# EAGLE design USB Breakout v0.3 (EAGLE 7.1.0)
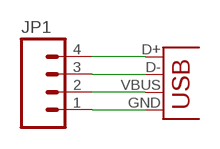
[diagram p0: schematic, sheet 1]

## Parts
JP1  M04LONGPADS  [1X04_LONGPADS]
JP2  USB-A-SMD  [USB-A-S-NOSILK-FEMALE]

## Nets
3V3: JP1.2 JP2.VBUS
GND: JP1.1 JP2.GND
IN0: JP1.4 JP2.D+
IN1: JP1.3 JP2.D-

## Library data of the parts
JP1 = SparkFun-Connectors:M04: Header 4 Standard 4-pin 0.1" header. Use with straight break away headers (SKU : PRT-00116), right angle break away headers (PRT-00553), swiss pins (PRT-00743), machine pins (PRT-00117), and female headers (PRT-00115). Molex polarized connector foot print use with SKU : PRT-08231 with associated crimp pins and housings. 1MM SMD Version SKU: PRT-10208
JP2 = SparkFun-Connectors:USB: USB Connectors USB-B-PTH is fully proven SKU : PRT-00139/CONN-08278 USB-miniB is fully proven SKU : PRT-00587 USB-A-PCB is untested. USB-A-H is throughly reviewed, but untested. Spark Fun Electronics SKU : PRT-00437 USB-B-SMT is throughly reviewed, but untested. Needs silkscreen touching up. USB-A-S has not been used/tested USB-MB-H has not been used/tested USB-MICROB has been used. CONN-09505; PROD_ID: CONN-09520

## Board
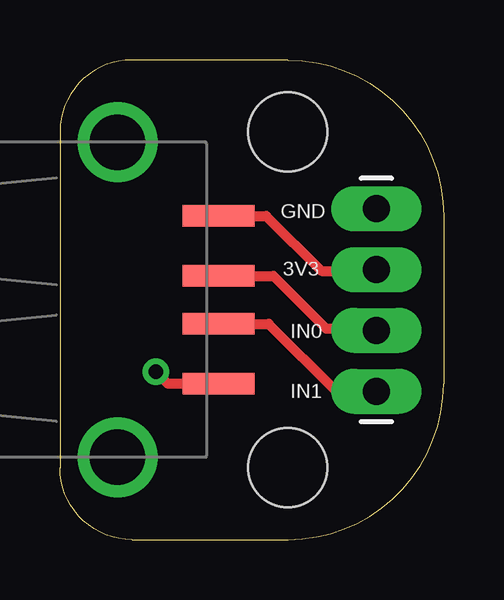
[diagram p1: board, top side]
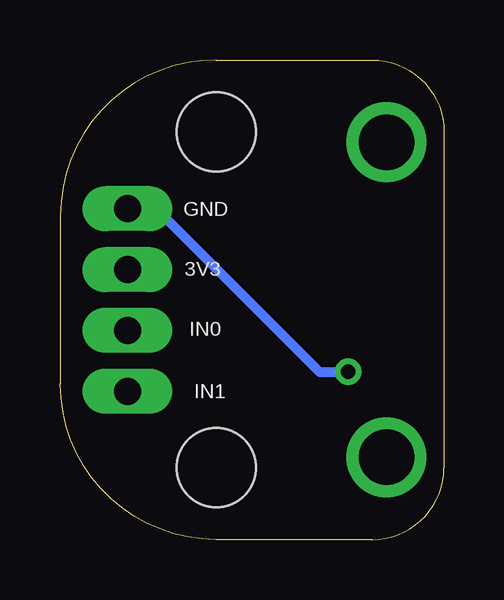
[diagram p2: board, bottom side, seen from below]

Size 16 x 20 mm. Coordinates in mm from the lower left corner, seen from the top.
Outline: 3,0 9.5,0 arc90 16,6.5 16,13.5 arc90 9.5,20 3,20 arc90 0,17 0,3 arc90 3,0
Copper layers (1*16): Top 0.035mm / dielectric 1.5mm / Bottom 0.035mm
Design rules "SparkFun": minimum track width 8mil, minimum drill 20mil, track to track 8mil, track to pad 8mil, pad to pad 8mil, via to via 8mil, smd to smd 8mil, copper to edge 10mil, drill to drill 8mil, minimum pad ring 12mil, minimum via ring 10mil, stop-mask expansion 4mil, vias tented up to drill 25mil, thermal gap 10mil

### Footprints (pad centres in the part's own frame; a part is rotated, then mirrored left to right if it is on the bottom)
1X04_LONGPADS = drill 1.118 pad 1.88 long: 1 0,0; 2 2.54,0; 3 5.08,0; 4 7.62,0
USB-A-S-NOSILK-FEMALE = smd 3 x 0.9: D+ 4.212,-1; D- 4.212,1; GND 4.212,-3.5; VBUS 4.212,3.5 | drill 2.311: S1 0,-6.566; S2 0,6.566
STAND-OFF = hole 3.302: 0,0

### Placement (x,y rotation side)
JP1  13.2,13.8 270 top
JP2  2.4,10 0 top
U$1  [STAND-OFF]  9.5,17 0 top
U$2  [STAND-OFF]  9.5,3 0 top

### Tracks (layer width: path | path; a pad name or v marks a point on that pad's centre or on a via)
3V3
  Top 0.406: JP2.VBUS 8.6,13.5 10.9,11.2 13.14,11.2 JP1.2
GND  (via drill 0.6)
  Top 0.406: JP2.GND 4.5,6.5 v4,7
  Bottom 0.406: JP1.1 12,13.8 5.2,7 v4,7
IN0
  Top 0.406: JP2.D+ 8.7,9 11.5,6.2 13.18,6.2 JP1.4
IN1
  Top 0.406: JP2.D- 8.9,11 11.1,8.8 13.12,8.8 JP1.3

### Text on the board
tPlace: GND | 3V3 | IN0 | IN1
bPlace: GND | 3V3 | IN0 | IN1